# Altium schematic sheet powerStage.SchDoc: MagLev
size A4; Date: 21/09/2014; DrawnBy: Andres Tosca; DocumentName: MagLev
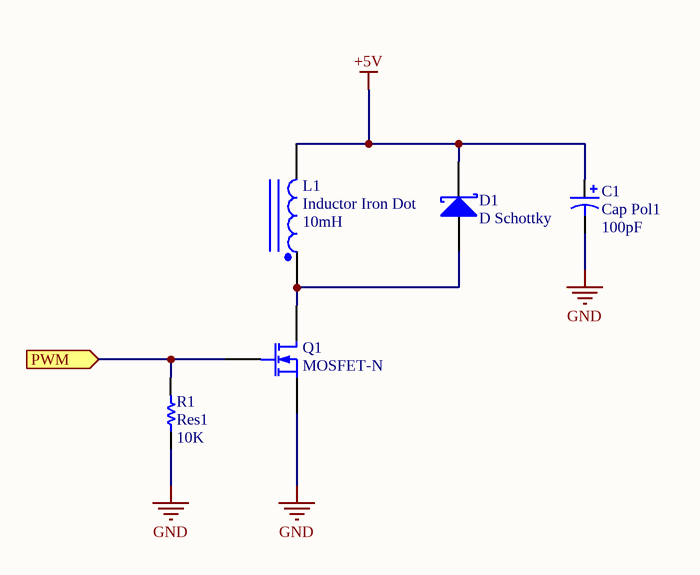
[diagram p0: powerStage.SchDoc]

## Parts
C1  Cap Pol1  value 100pF  [RB7.6-15]
D1  D Schottky  [SMB]
L1  Inductor Iron Dot  value 10mH  [DIODE_SMC]
Q1  MOSFET-N  [E3]
R1  Res1  value 10K  [AXIAL-0.3]

## Ports
PWM (in)

## Nets
+5V: C1.1 D1.2(K) L1.2
GND: C1.2 Q1.3(S) R1.1
PWM: Q1.2(G) R1.2 ; port PWM
NetD1_1: D1.1(A) L1.1 Q1.1(D)

## Library data of the parts
C1 = Cap Pol1: Polarized Capacitor (Radial); Published: 8-Jun-2000; LatestRevisionDate: 17-Jul-2002; LatestRevisionNote: Re-released for DXP Platform.; PackageReference: RB7.6-15; Publisher: Altium Limited; PackageDescription: Polarized Capacitor (Radial); 2 Leads
D1 = D Schottky: Schottky Diode; Published: 8-Jun-2000; LatestRevisionDate: 17-Jul-2002; LatestRevisionNote: Re-released for DXP Platform.; PackageReference: SMB; Publisher: Altium Limited; PackageDescription: DO-214-AA/SMB; 2 C-Bend Leads; Body 5.3 x 3.6 mm, inc. leads (LxW); Code_JEDEC: DO-214-AA
L1 = Inductor Iron Dot: Magnetic-Core Inductor with Winding Polarity Marking; Published: 24-Mar-1999; LatestRevisionDate: 17-Jul-2002; LatestRevisionNote: Re-released for DXP Platform.; PackageReference: DIODE_SMC; Publisher: Altium Limited; PackageDescription: Diode; 2 Leads
Q1 = MOSFET-N: N-Channel MOSFET; Published: 8-Jun-2000; LatestRevisionDate: 17-Jul-2002; LatestRevisionNote: Re-released for DXP Platform.; PackageVersion: 1995/1996; PackageReference: E3; Publisher: Altium Limited; PackageDescription: TO, Flat Index; 3 In-Line, Axial Leads; Body Dia. 4.6mm; Lead Dia. 0.5 mm (max)
R1 = Res1: Resistor; Published: 8-Jun-2000; LatestRevisionDate: 17-Jul-2002; LatestRevisionNote: Re-released for DXP Platform.; PackageReference: AXIAL-0.3; Publisher: Altium Limited; PackageDescription: Axial Device, Thru-Hole; 2 Leads; 0.3 in Pin Spacing